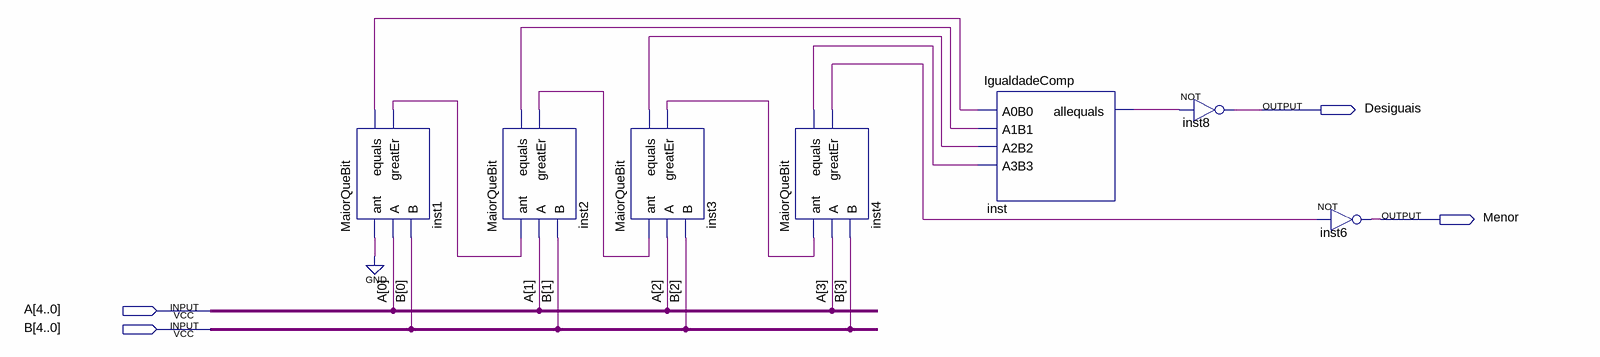
[diagram p0: schematic sheet]
// Quartus schematic CompModulo.bdf as structural Verilog: 7 symbols, 4 pins
module CompModulo (
  input  [4:0] A,
  input  [4:0] B,
  output Desiguais,
  output Menor
);

  wire inst1_equals, inst1_greater, inst2_equals, inst2_greater, inst3_equals, inst3_greater, inst4_equals,
       inst4_greater, inst_allequals;

  MaiorQueBit inst1 (.ant(1'b0), .A(A[0]), .B(B[0]), .equals(inst1_equals), .greatEr(inst1_greater));
  MaiorQueBit inst2 (.ant(inst1_greater), .A(A[1]), .B(B[1]), .equals(inst2_equals), .greatEr(inst2_greater));
  MaiorQueBit inst3 (.ant(inst2_greater), .A(A[2]), .B(B[2]), .equals(inst3_equals), .greatEr(inst3_greater));
  MaiorQueBit inst4 (.ant(inst3_greater), .A(A[3]), .B(B[3]), .equals(inst4_equals), .greatEr(inst4_greater));
  IgualdadeComp inst (
    .A0B0(inst1_equals), .A1B1(inst2_equals), .A2B2(inst3_equals), .A3B3(inst4_equals),
    .allequals(inst_allequals));
  not inst8 (Desiguais, inst_allequals);
  not inst6 (Menor, inst4_greater);
endmodule
